# Altium project ESP32 with USBC.PrjPcb
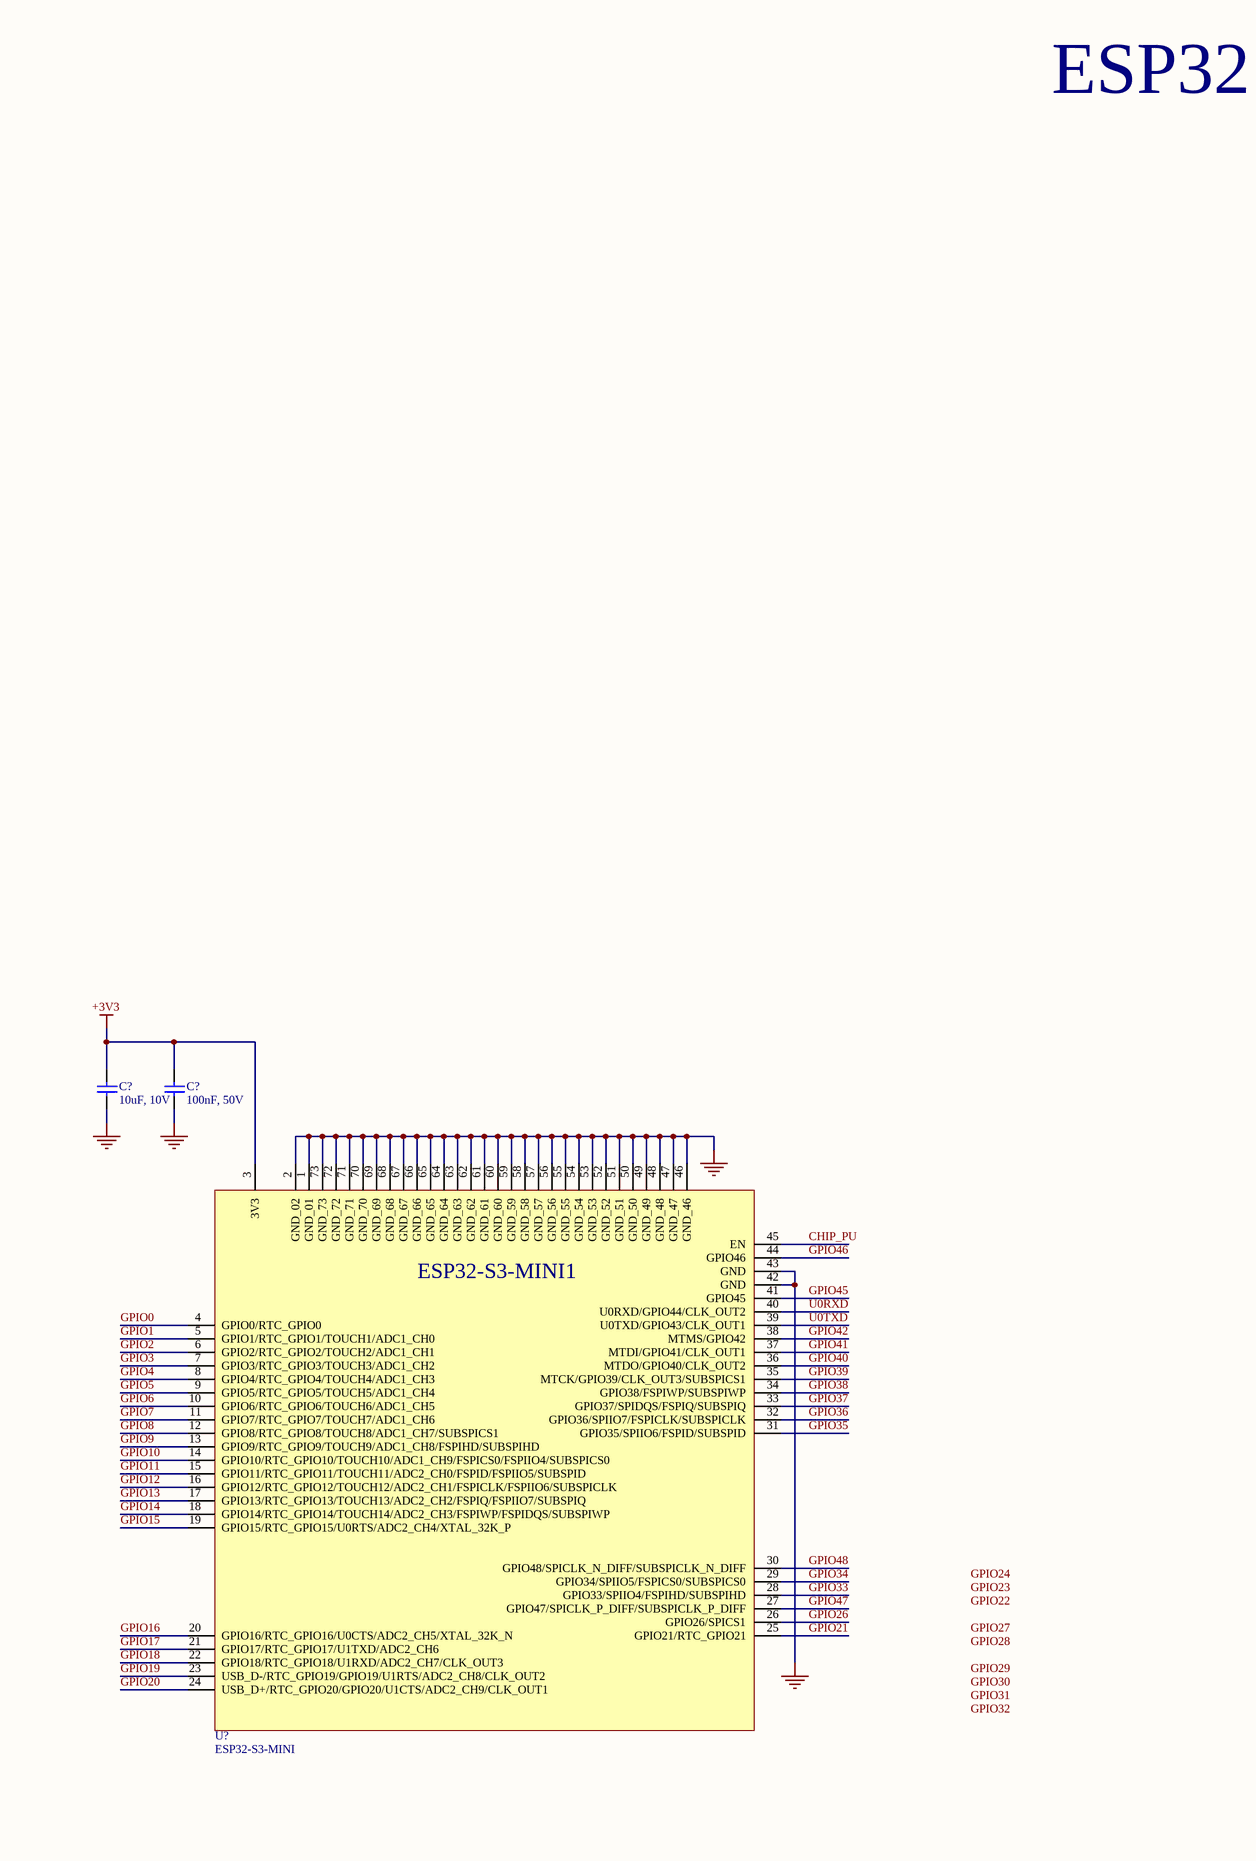
[diagram p0: ESP32 with USBC.SchDoc, left]
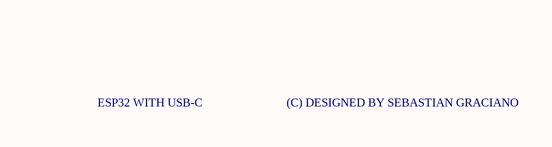
[diagram p1: ESP32 with USBC.SchDoc, right]
1 sheet, 3 parts. Net scope: global (net labels, ports and power ports of the same name join across sheets).
Board file: ESP32 with USBC.PcbDoc

## Sheet ESP32 with USBC.SchDoc
size A2; SheetNumber: 1; SheetTotal: 1

### Parts
(Parts that share a designator on the sheet are numbered #1, #2 ... from top to bottom, then left to right.)
C?#1  10uF, 10V
C?#2  100nF, 50V
U?  ESP32-S3-MINI

### Nets
+3V3: C?#1.2 C?#2.0 U?.3(3V3)
GND: C?#1.1 C?#2.1 U?.1(GND_01) U?.2(GND_02) U?.42(GND) U?.43(GND) U?.46(GND_46) U?.47(GND_47) U?.48(GND_48) U?.49(GND_49) U?.50(GND_50) U?.51(GND_51) U?.52(GND_52) U?.53(GND_53) U?.54(GND_54) U?.55(GND_55) U?.56(GND_56) U?.57(GND_57) U?.58(GND_58) U?.59(GND_59) U?.60(GND_60) U?.61(GND_61) U?.62(GND_62) U?.63(GND_63) U?.64(GND_64) U?.65(GND_65) U?.66(GND_66) U?.67(GND_67) U?.68(GND_68) U?.69(GND_69) U?.70(GND_70) U?.71(GND_71) U?.72(GND_72) U?.73(GND_73)
CHIP_PU: U?.45(EN)
GPIO0: U?.4(GPIO0/RTC_GPIO0)
GPIO1: U?.5(GPIO1/RTC_GPIO1/TOUCH1/ADC1_CH0)
GPIO2: U?.6(GPIO2/RTC_GPIO2/TOUCH2/ADC1_CH1)
GPIO3: U?.7(GPIO3/RTC_GPIO3/TOUCH3/ADC1_CH2)
GPIO4: U?.8(GPIO4/RTC_GPIO4/TOUCH4/ADC1_CH3)
GPIO5: U?.9(GPIO5/RTC_GPIO5/TOUCH5/ADC1_CH4)
GPIO6: U?.10(GPIO6/RTC_GPIO6/TOUCH6/ADC1_CH5)
GPIO7: U?.11(GPIO7/RTC_GPIO7/TOUCH7/ADC1_CH6)
GPIO8: U?.12(GPIO8/RTC_GPIO8/TOUCH8/ADC1_CH7/SUBSPICS1)
GPIO9: U?.13(GPIO9/RTC_GPIO9/TOUCH9/ADC1_CH8/FSPIHD/SUBSPIHD)
GPIO10: U?.14(GPIO10/RTC_GPIO10/TOUCH10/ADC1_CH9/FSPICS0/FSPIIO4/SUBSPICS0)
GPIO11: U?.15(GPIO11/RTC_GPIO11/TOUCH11/ADC2_CH0/FSPID/FSPIIO5/SUBSPID)
GPIO12: U?.16(GPIO12/RTC_GPIO12/TOUCH12/ADC2_CH1/FSPICLK/FSPIIO6/SUBSPICLK)
GPIO13: U?.17(GPIO13/RTC_GPIO13/TOUCH13/ADC2_CH2/FSPIQ/FSPIIO7/SUBSPIQ)
GPIO14: U?.18(GPIO14/RTC_GPIO14/TOUCH14/ADC2_CH3/FSPIWP/FSPIDQS/SUBSPIWP)
GPIO15: U?.19(GPIO15/RTC_GPIO15/U0RTS/ADC2_CH4/XTAL_32K_P)
GPIO16: U?.20(GPIO16/RTC_GPIO16/U0CTS/ADC2_CH5/XTAL_32K_N)
GPIO17: U?.21(GPIO17/RTC_GPIO17/U1TXD/ADC2_CH6)
GPIO18: U?.22(GPIO18/RTC_GPIO18/U1RXD/ADC2_CH7/CLK_OUT3)
GPIO19: U?.23(USB_D-/RTC_GPIO19/GPIO19/U1RTS/ADC2_CH8/CLK_OUT2)
GPIO20: U?.24(USB_D+/RTC_GPIO20/GPIO20/U1CTS/ADC2_CH9/CLK_OUT1)
GPIO21: U?.25(GPIO21/RTC_GPIO21)
GPIO26: U?.26(GPIO26/SPICS1)
GPIO33: U?.28(GPIO33/SPIIO4/FSPIHD/SUBSPIHD)
GPIO34: U?.29(GPIO34/SPIIO5/FSPICS0/SUBSPICS0)
GPIO35: U?.31(GPIO35/SPIIO6/FSPID/SUBSPID)
GPIO36: U?.32(GPIO36/SPIIO7/FSPICLK/SUBSPICLK)
GPIO37: U?.33(GPIO37/SPIDQS/FSPIQ/SUBSPIQ)
GPIO38: U?.34(GPIO38/FSPIWP/SUBSPIWP)
GPIO39: U?.35(MTCK/GPIO39/CLK_OUT3/SUBSPICS1)
GPIO40: U?.36(MTDO/GPIO40/CLK_OUT2)
GPIO41: U?.37(MTDI/GPIO41/CLK_OUT1)
GPIO42: U?.38(MTMS/GPIO42)
GPIO45: U?.41(GPIO45)
GPIO46: U?.44(GPIO46)
GPIO47: U?.27(GPIO47/SPICLK_P_DIFF/SUBSPICLK_P_DIFF)
GPIO48: U?.30(GPIO48/SPICLK_N_DIFF/SUBSPICLK_N_DIFF)
U0RXD: U?.40(U0RXD/GPIO44/CLK_OUT2)
U0TXD: U?.39(U0TXD/GPIO43/CLK_OUT1)

### Notes on the sheet
- ESP32 WITH USB-C
- (C) DESIGNED BY SEBASTIAN GRACIANO
- Labels drawn without touching a wire or pin: GPIO22, GPIO23, GPIO24, GPIO27, GPIO28, GPIO29, GPIO30, GPIO31, GPIO32
- (in symbol ESP32-S3-MINI-1-N8) ESP32-S3-MINI1

### Library data of the parts
C?#1 = CL05A106MP8NUB8: Ceramic Capacitor, Multilayer, Ceramic, 10V, 20% +Tol, 20% -Tol, X5R, 15% TC, 10uF, Surface Mount, 0402; Manufacturer: Samsung; Multilayer: Yes; Supplier: Digikey; Supplier Part Number: 1276-6830-6-ND; Manufacturer Part Number: CL05A106MP8NUB8; RoHS: Yes; Category: Ceramic Capacitors; Stock: 90946; Pricing: 1=0.2, 10=0.12, 100=0.0808, 1000=0.06854 (USD); Mounting Technology: Surface Mount; Pins: 2; Dielectric Material: Ceramic; Package Shape: Rectangular; Case/Package: 0402; Terminal Finish: Nickel; Min Operating Temperature: -55°C; Max Operating Temperature: 85°C; JESD-609 Code: e3; Value: 10uF; Capacitor Type: Ceramic; Tolerance  (fill in as +-): 20%; Packaging: Tape and Reel; Tolerance (fill in as +-): 20%; Rated DC Voltage (URdc): 10V; Temperature Characteristics Code: X5R; Termination: Wraparound; Reach SVHC Compliant: Yes; RoHS Compliant: Yes; ComponentLink1URL: https://datasheet.ciiva.com:443/pdfs/VipMasterIC/IC/SEMS/SEMS-S-A0008521219/SEMS-S-A0008521325-1.pdf?src-supplier=IHS+Markit; ComponentLink1Description: https://datasheet.ciiva.com:443/pdfs/VipMasterIC/IC/SEMS/SEMS-S-A0008521219/SEMS-S-A0008521325-1.pdf?src-supplier=IHS+Markit; ComponentLink2URL: http://www.samsungsem.com/kr/support/product-search/mlcc/CL05A106MP8NUB8.jsp?src-supplier=Digikey; ComponentLink2Description: http://www.samsungsem.com/kr/support/product-search/mlcc/CL05A106MP8NUB8.jsp?src-supplier=Digikey; ComponentLink3URL: https://datasheet.octopart.com/CL05A106MP8NUB8-Samsung-Electro-Mechanics-datasheet-136460857.pdf?src-supplier=Future+Electronics; ComponentLink3Description: https://datasheet.octopart.com/CL05A106MP8NUB8-Samsung-Electro-Mechanics-datasheet-136460857.pdf?src-supplier=Future+Electronics; LCSC Part Number: C307415
C?#2 = CL05B104KB54PNC: Ceramic Capacitor, Multilayer, Ceramic, 50V, 10% +Tol, 10% -Tol, X7R, 15% TC, 0.1uF, Surface Mount, 0402; Manufacturer: Samsung; Supplier: Digikey; Supplier Part Number: 1276-CL05B104KB54PNCCT-ND; Manufacturer Part Number: CL05B104KB54PNC; RoHS: Yes; Category: Ceramic Capacitors; Stock: 393407; Pricing: 1=0.1, 10=0.037, 100=0.0211, 1000=0.01333, 2500=0.01141, 5000=0.01026 (USD); Pins: 2; Dielectric Material: Ceramic; Capacitor Type: Ceramic; RoHS Compliant: Yes; Reach SVHC Compliant: Yes; ComponentLink1URL: https://datasheet.ciiva.com:443/pdfs/VipMasterIC/IC/SEMS/SEMS-S-A0006318249/SEMS-S-A0006320959-1.pdf?src-supplier=IHS+Markit; ComponentLink1Description: https://datasheet.ciiva.com:443/pdfs/VipMasterIC/IC/SEMS/SEMS-S-A0006318249/SEMS-S-A0006320959-1.pdf?src-supplier=IHS+Markit; ComponentLink2URL: https://datasheet.octopart.com/CL05B104KB54PNC-Samsung-datasheet-8326407.pdf?src-supplier=TME; ComponentLink2Description: https://datasheet.octopart.com/CL05B104KB54PNC-Samsung-datasheet-8326407.pdf?src-supplier=TME; LCSC Part Number: C307331
U? = ESP32-S3-MINI-1-N8: SMD module, ESP32-S3FN8, 8 MB SPI flash, PCB antenna; Manufacturer: Espressif Systems; Supplier: Digikey; Supplier Part Number: 5407-ESP32-S3-MINI-1-N8CT-ND; Manufacturer Part Number: ESP32-S3-MINI-1-N8; RoHS: No; Category: LDO; Pricing: 1=5.28, 10=4.566, 25=4.3196, 100=3.9802, 250=3.7768 (USD); ComponentLink1URL: https://datasheet.octopart.com/ESP32-S3-MINI-1-N8-Espressif-Systems-datasheet-165560562.pdf?src-supplier=TME; ComponentLink1Description: https://datasheet.octopart.com/ESP32-S3-MINI-1-N8-Espressif-Systems-datasheet-165560562.pdf?src-supplier=TME; LCSC Part Number: C2913206